# EAGLE design rgb_breakout (EAGLE 7.5.0)

## Sheet 1 of 2
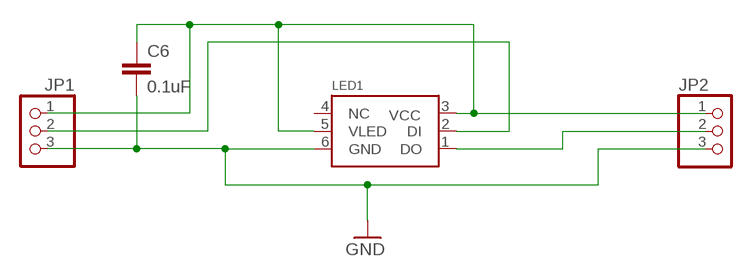
[diagram p0: schematic, sheet 1]

### Parts
C6  0.1uF  C-EUC0805  [C0805]
JP1  PINHD-1X3  [1X03]
JP2  PINHD-1X3  [1X03]
LED1  5050WS2811W  [RGBLED5050W]

### Nets
GND [GND]: C6.2 JP1.3 JP2.3 LED1.6(GND)
N$3: JP2.2 LED1.1(DO)
N$4: JP1.2 LED1.2(DI)
VCC [VCC]: C6.1 JP1.1 JP2.1 LED1.3(VCC) LED1.5(VLED)
Unconnected: LED1.4(NC)

## Sheet 2 of 2

## Library data of the parts
C6 = resistor:C-EU: CAPACITOR, European symbol
JP1 JP2 = pinhead:PINHD-1X3: PIN HEADER
LED1 = 5050WS2811:5050WS2811

## Net classes
0 default: width 0.016 mm, clearance 0.152 mm
1 GND: width 0.016 mm, drill 0.508 mm, clearance 0.152 mm
2 VCC: width 0.025 mm, drill 0.508 mm, clearance 0.152 mm

## Board
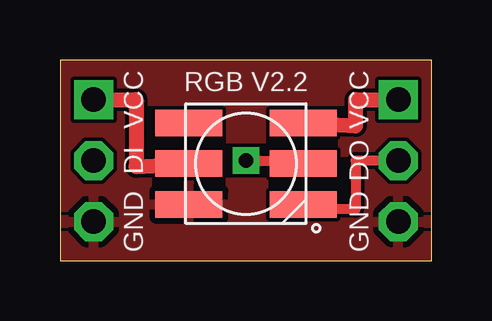
[diagram p1: board, top side]
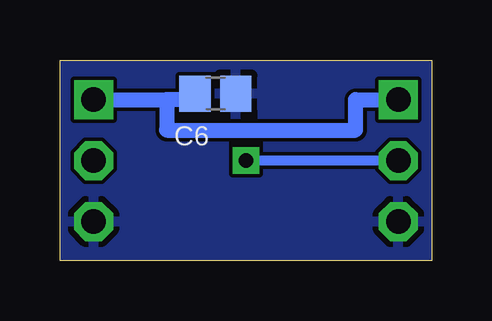
[diagram p2: board, bottom side, seen from below]

Size 15.49 x 8.36 mm. Coordinates in mm from the lower left corner, seen from the top.
Outline: 0,0 15.49,0 15.49,8.36 0,8.36 0,0
Copper layers (1*16): Top 0.035mm / dielectric 1.5mm / Bottom 0.035mm
Design rules "SparkFun *": minimum track width 30mil, minimum drill 20mil, track to track 6mil, track to pad 6mil, pad to pad 6mil, via to via 6mil, smd to smd 6mil, copper to edge 1mil, drill to drill 1mil, minimum pad ring 12mil, minimum via ring 10mil, stop-mask expansion 4mil, vias tented up to drill 25mil, thermal gap 10mil

### Footprints (pad centres in the part's own frame; a part is rotated, then mirrored left to right if it is on the bottom)
C0805 = smd 1.3 x 1.5: 1 -0.85,0; 2 0.85,0
1X03 = drill 1.016 square: 1 -2.54,0 | drill 1.016 octagon: 2 0,0; 3 2.54,0
RGBLED5050W = smd 2.794 x 1.1: 1 -2.381,1.7; 2 -2.381,0; 3 -2.381,-1.7; 4 2.381,-1.7; 5 2.381,0; 6 2.381,1.7

### Placement (x,y rotation side)
C6  9.02,6.97 0 bottom
JP1  1.4,4.17 270 top
JP2  14.1,4.17 270 top
LED1  7.75,4.04 180 top

### Tracks (layer width: path | path; a pad name or v marks a point on that pad's centre or on a via)
GND
  pour Top: -0.51,8.74 16,8.74 16,-0.15 -0.51,-0.15
  pour Bottom: -0.51,8.74 15.75,8.74 15.75,-0.15 -0.51,-0.15
N$3
  Top 0.406: JP2.2 12.32,4.17 12.32,2.14 10.13,2.14 LED1.1
N$4  (via drill 0.6)
  Top 0.406: v7.75,4.17 10.13,4.17 LED1.2
  Bottom 0.406: JP1.2 v7.75,4.17
VCC
  Top 0.635: JP1.1 3.18,6.71 3.18,3.92 LED1.5 | LED1.3 12.32,5.62 12.32,6.71 JP2.1
  Bottom 0.635: JP2.1 11.05,6.71 | C6.1 9.87,6.71 11.05,6.71 | 11.05,6.71 11.05,5.44 3.18,5.44 3.18,6.71 JP1.1

### Text on the board
tNames: RGB V2.2 | VCC | VCC | DI | DO | GND | GND